# EAGLE design POE_PD_4_P-Schalter (EAGLE 6.5.0)
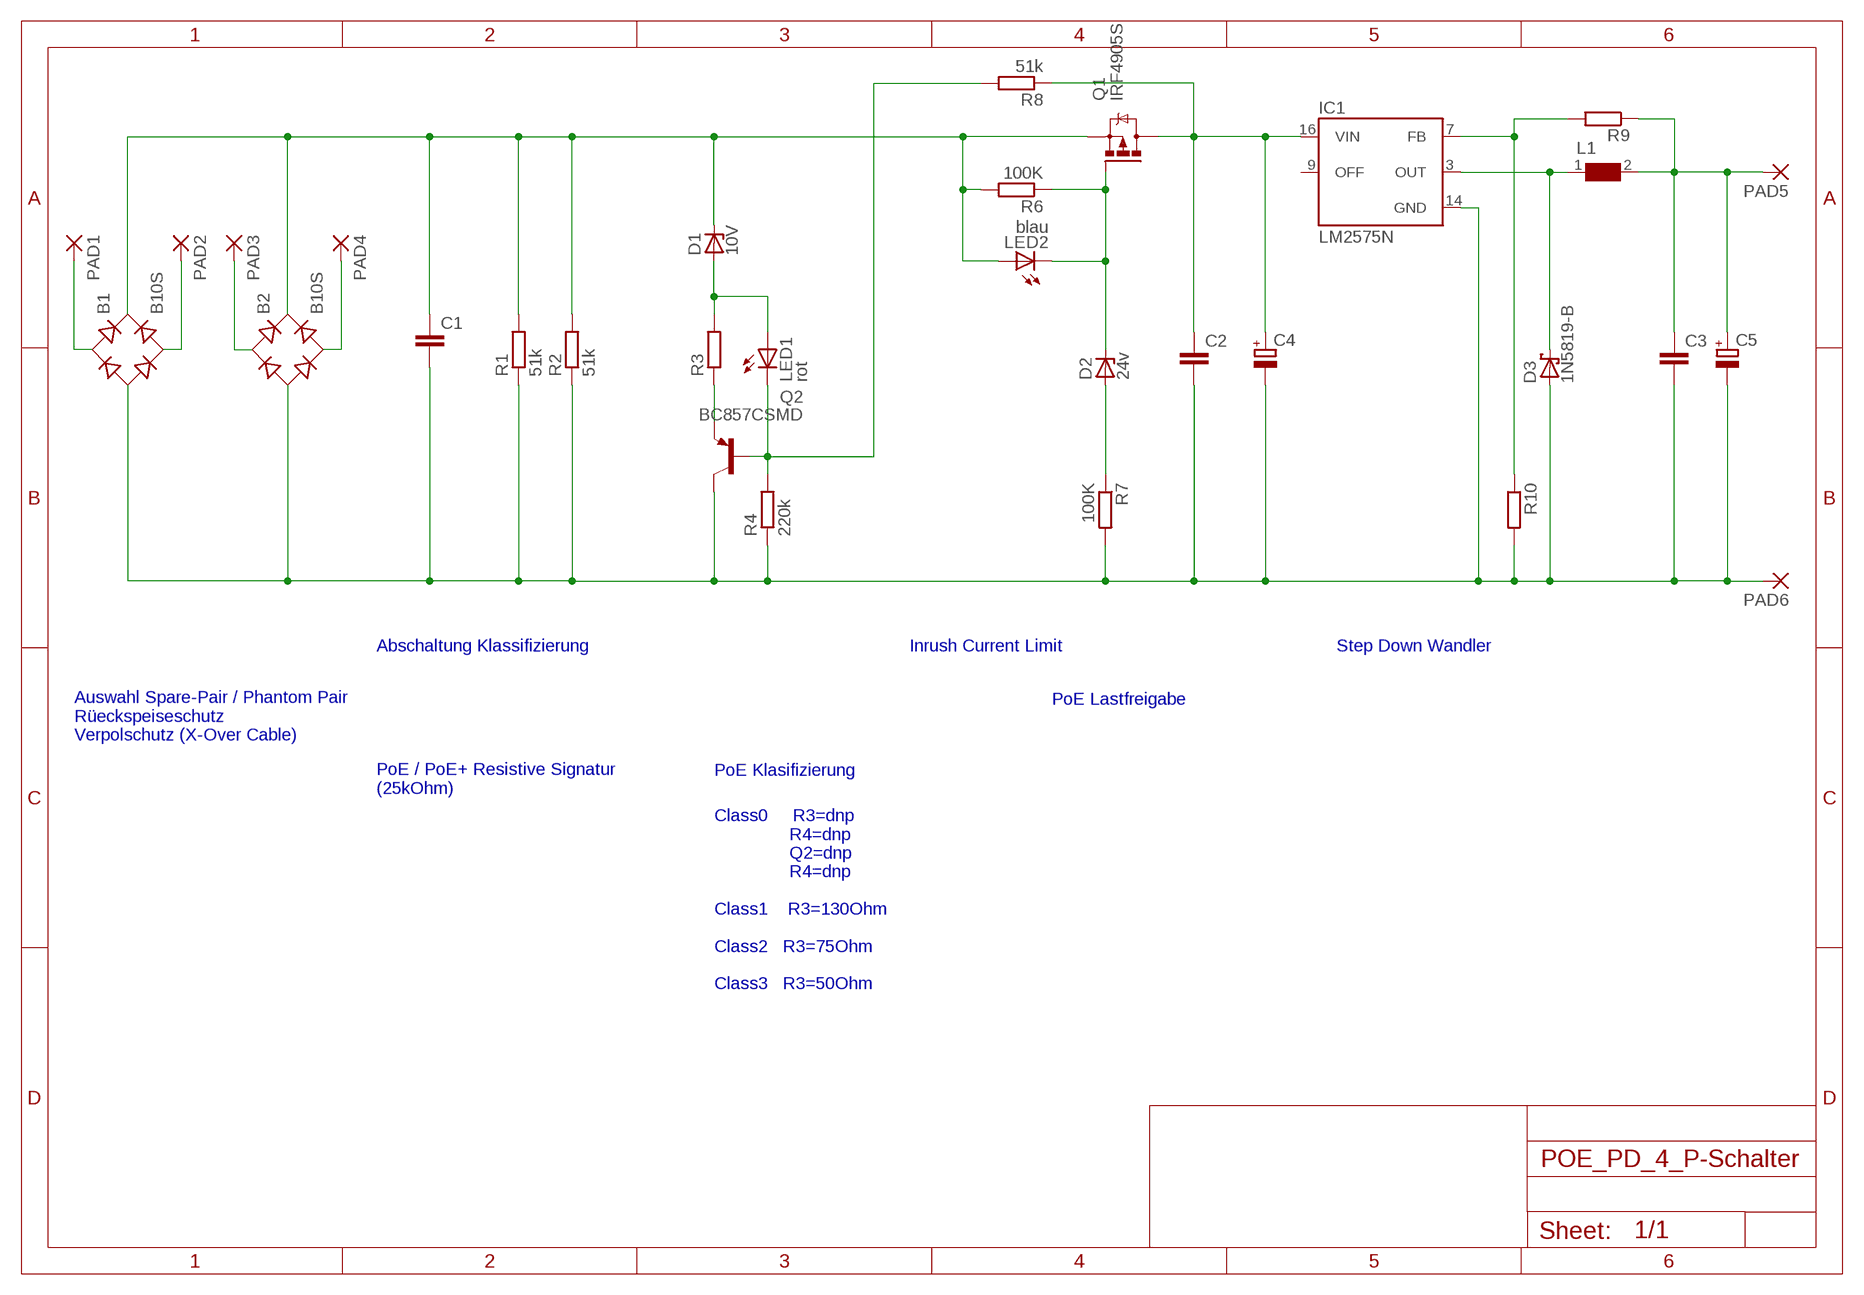
[diagram p0: schematic, sheet 1]

## Parts
B1  B10S  [MBS]
B2  B10S  [MBS]
C1  C-EUC0805  [C0805]
C2  C-EUC0805  [C0805]
C3  C-EUC0805  [C0805]
C4  CPOL-EU153CLV-0605  [153CLV-0605]
C5  CPOL-EU153CLV-0605  [153CLV-0605]
D1  10V  ZENER-DIODESOT23  [SOT23]
D2  24v  ZENER-DIODESOT23  [SOT23]
D3  1N5819-B  [DO41-7.6]
IC1  LM2575N  [DIL16]
L1  WE-PD2_S  [WE-PD2_S]
LED1  rot  LEDCHIP-LED0805  [CHIP-LED0805]
LED2  blau  LEDCHIP-LED0805  [CHIP-LED0805]
PAD1  2,15/1,0  [2,15/1,0]
PAD2  2,15/1,0  [2,15/1,0]
PAD3  2,15/1,0  [2,15/1,0]
PAD4  2,15/1,0  [2,15/1,0]
PAD5  2,15/1,0  [2,15/1,0]
PAD6  2,15/1,0  [2,15/1,0]
Q1  IRF4905S  IRFR5305  [D-PAK_TO252AA]
Q2  BC857CSMD  [SOT23-BEC]
R1  51k  R-EU_R0603  [R0603]
R2  51k  R-EU_R0603  [R0603]
R3  R-EU_R0603  [R0603]
R4  220k  R-EU_R0603  [R0603]
R6  100K  R-EU_R0603  [R0603]
R7  100K  R-EU_R0603  [R0603]
R8  51k  R-EU_R0603  [R0603]
R9  R-EU_R0603  [R0603]
R10  R-EU_R0603  [R0603]

## Nets
N$1: B1.- B2.- C1.2 C2.2 C3.2 C4.- C5.- D3.A IC1.14(GND) PAD6.1(P) Q2.C R1.1 R2.1 R4.1 R7.2 R10.2
N$4: Q2.E R3.1
N$5: B1.AC1 PAD1.1(P)
N$6: LED1.C Q2.B R4.2 R8.2
N$8: D1.1(A) LED1.A R3.2
N$9: D2.1(A) R7.1
N$10: B1.+ B2.+ C1.1 D1.3(C) LED2.A Q1.3(S) R1.2 R2.2 R6.2
N$11: D2.3(C) LED2.C Q1.1(G) R6.1
N$12: D3.C IC1.3(OUT) L1.1
N$13: C3.1 C5.+ L1.2 PAD5.1(P) R9.1
N$14: C2.1 C4.+ IC1.16(VIN) Q1.4(D) R8.1
N$15: IC1.7(FB) R9.2 R10.1
N$16: B1.AC2 PAD2.1(P)
N$17: B2.AC1 PAD3.1(P)
N$18: B2.AC2 PAD4.1(P)
Unconnected: IC1.9(OFF)

## Notes on the sheet
- Abschaltung Klassifizierung | Inrush Current Limit | Step Down Wandler
- PoE Lastfreigabe
- Auswahl Spare-Pair / Phantom Pair
  Rüeckspeiseschutz
  Verpolschutz (X-Over Cable)
- PoE Klasifizierung
- PoE / PoE+ Resistive Signatur
  (25kOhm)
- Class0     R3=dnp
                 R4=dnp
                 Q2=dnp
                 R4=dnp
  
  Class1    R3=130Ohm
  
  Class2   R3=75Ohm
  
  Class3   R3=50Ohm

## Library data of the parts
B1 B2 = rectifier:B*S: Surface Mount Glass Passivated Bridge Rectifiers Source: Comchip Bridge Rectifiers B05S-G_B10S-G.pdf
C1-C3 = rcl:C-EU: CAPACITOR, European symbol
C4 C5 = rcl:CPOL-EU: POLARIZED CAPACITOR, European symbol
D1 D2 = diode:ZENER-DIODE: Z-Diode
D3 = diode:1N581*: 1.0A SCHOTTKY BARRIER RECTIFIER Source: http://www.diodes.com/datasheets/ds23001.pdf
IC1 = v-reg-3:LM2575: National Semiconductor <http://www.national.com> 1.0A "Simple Switcher"(c) 52kHz, Vout 1.23-37V (HV: 57V), Vin 40V (HV: 60V), 50µA standby current
L1 = wuerth_elektronik_EAGLE:WE-PD2: SMD-Power Inductors WE-PD2 Is recommended for the application with switching regulators from National Semiconductor, Linear Technology, Texas Instruments and Fairchild Semiconductor -- Switching regulators with low operating voltages (computer, laptop, mobile phones, pagers) -- Integrated DC/DC-converter
LED1 LED2 = led:LED: LED OSRAM: - CHIPLED LG R971, LG N971, LY N971, LG Q971, LY Q971, LO R971, LY R971 LH N974, LH R974 LS Q976, LO Q976, LY Q976 LO Q996 - Hyper CHIPLED LW Q18S LB Q993, LB Q99A, LB R99A - SideLED LS A670, LO A670, LY A670, LG A670, LP A670 LB A673, LV A673, LT A673, LW A673 LH A674 LY A675 LS A676, LA A676, LO A676, LY A676, LW A676 LS A679, LY A679, LG A679 - Hyper Micro SIDELED® LS Y876, LA Y876, LO Y876, LY Y876 LT Y87S - SmartLED LW L88C, LW L88S LB L89C, LB L89S, LG L890 LS L89K, LO L89K, LY L89K LS L896, LA L896, LO L896, LY L896 - TOPLED LS T670, LO T670, LY T670, LG T670, LP T670 LSG T670, LSP T670, LSY T670, LOP T670, LYG T670 LG T671, LOG T671, LSG T671 LB T673, LV T673, LT T673, LW T673 LH T674 LS T676, LA T676, LO T676, LY T676, LB T676, LH T676, LSB T676, LW T676 LB T67C, LV T67C, LT T67C, LS T67K, LO T67K, LY T67K, LW E67C LS E67B, LA E67B, LO E67B, LY E67B, LB E67C, LV E67C, LT E67C LW T67C LS T679, LY T679, LG T679 LS T770, LO T770, LY T770, LG T770, LP T770 LB T773, LV T773, LT T773, LW T773 LH T774 LS E675, LA E675, LY E675, LS T675 LS T776, LA T776, LO T776, LY T776, LB T776 LHGB T686 LT T68C, LB T68C - Hyper Mini TOPLED® LB M676 - Mini TOPLED Santana® LG M470 LS M47K, LO M47K, LY M47K Source: http://www.osram.convergy.de LUXEON: - LUMILED® LXK2-PW12-R00, LXK2-PW12-S00, LXK2-PW14-U00, LXK2-PW14-V00 LXK2-PM12-R00, LXK2-PM12-S00, LXK2-PM14-U00 LXK2-PE12-Q00, LXK2-PE12-R00, LXK2-PE12-S00, LXK2-PE14-T00, LXK2-PE14-U00 LXK2-PB12-K00, LXK2-PB12-L00, LXK2-PB12-M00, LXK2-PB14-N00, LXK2-PB14-P00, LXK2-PB14-Q00 LXK2-PR12-L00, LXK2-PR12-M00, LXK2-PR14-Q00, LXK2-PR14-R00 LXK2-PD12-Q00, LXK2-PD12-R00, LXK2-PD12-S00 LXK2-PH12-R00, LXK2-PH12-S00 LXK2-PL12-P00, LXK2-PL12-Q00, LXK2-PL12-R00 Source: www.luxeon.com KINGBRIGHT: KA-3528ASYC Source: www.kingbright.com
PAD1-PAD6 = wirepad:2,15/1,0: THROUGH-HOLE PAD
Q1 = transistor-power:IRF?5305: HEXFET Power MOSFET Source: http://www.irf.com/product-info/datasheets/data/irfr5305pbf.pdf
Q2 = transistor-pnp:BC857*: PNP Transistror
R1-R4 R6-R10 = rcl:R-EU_: RESISTOR, European symbol

## Board
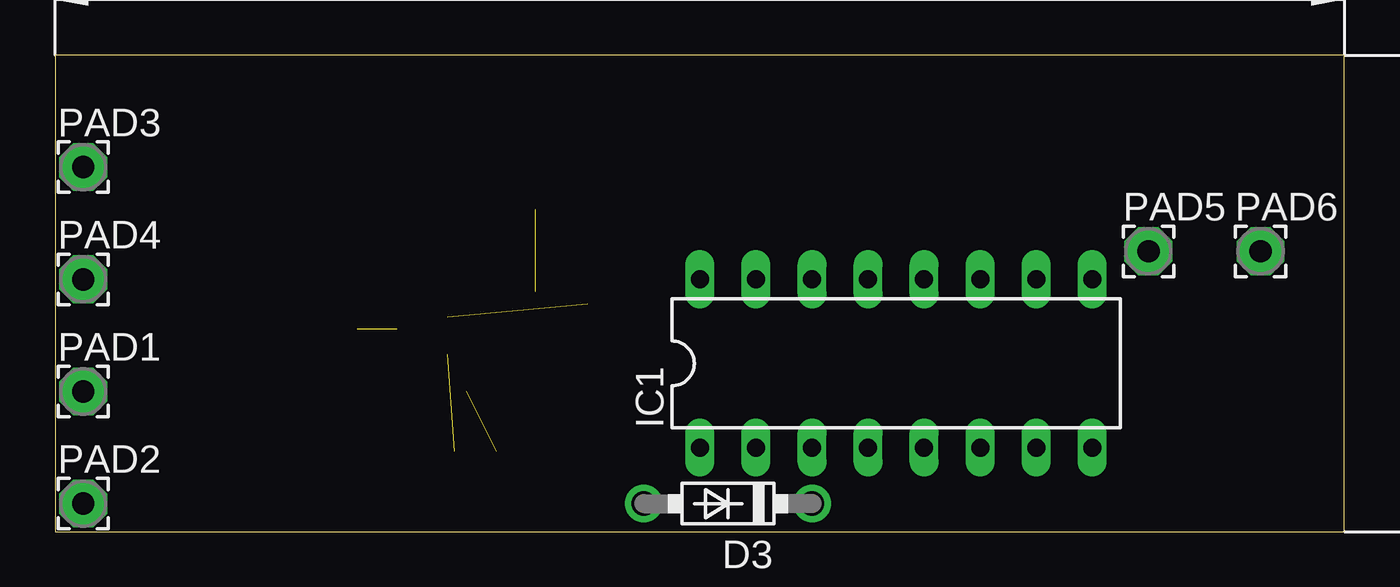
[diagram p1: board, top side]
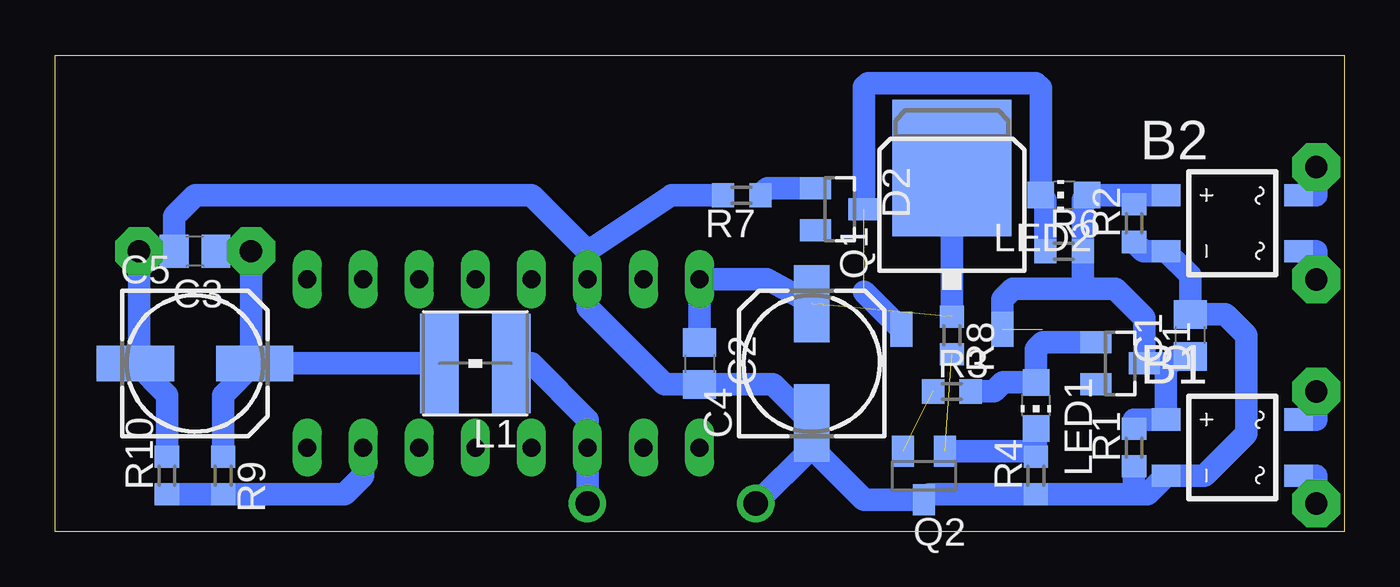
[diagram p2: board, bottom side, seen from below]

Size 58.41 x 21.58 mm. Coordinates in mm from the lower left corner, seen from the top.
Outline: 0,0 58.41,0 58.41,21.58 0,21.58 0,0
Copper layers (1*16): Top 0.035mm / dielectric 1.5mm / Bottom 0.035mm
Design rules "default": minimum track width 10mil, minimum drill 0.6mm, track to track 8mil, track to pad 8mil, pad to pad 8mil, via to via 8mil, smd to smd 8mil, copper to edge 40mil, drill to drill 8mil, minimum pad ring 10mil, minimum via ring 8mil, stop-mask expansion 4mil, vias tented up to drill 0mil, thermal gap 10mil

### Footprints (pad centres in the part's own frame; a part is rotated, then mirrored left to right if it is on the bottom)
MBS = smd 1 x 1.3: + -1.27,-3; - 1.27,-3; AC1 -1.27,3; AC2 1.27,3
C0805 = smd 1.3 x 1.5: 1 -0.95,0; 2 0.95,0
153CLV-0605 = smd 3.5 x 1.6: + 2.7,0; - -2.7,0
SOT23 = smd 1 x 1.4: 1 -0.95,-1.1; 2 0.95,-1.1; 3 0,1.1
DO41-7.6 = drill 1.1 pad 1.7: A 3.81,0; C -3.81,0
DIL16 = drill 0.813 long: 1 -8.89,-3.81; 2 -6.35,-3.81; 3 -3.81,-3.81; 4 -1.27,-3.81; 5 1.27,-3.81; 6 3.81,-3.81; 7 6.35,-3.81; 8 8.89,-3.81; 9 8.89,3.81; 10 6.35,3.81; 11 3.81,3.81; 12 1.27,3.81; 13 -1.27,3.81; 14 -3.81,3.81; 15 -6.35,3.81; 16 -8.89,3.81
WE-PD2_S = smd 1.75 x 4.5: 1 -1.625,0; 2 1.625,0
CHIP-LED0805 = smd 1.2 x 1.2: A 0,-1.05; C 0,1.05
2,15/1,0 = drill 1.016 pad 2.159 octagon: 1 0,0
D-PAK_TO252AA = smd 1 x 1.6: 1 -2.28,-4.8; 3 2.28,-4.8 | smd 5.4 x 6.2: 4 0,2.5
SOT23-BEC = smd 1 x 1.4: B -0.95,-1.1; C 0,1.1; E 0.95,-1.1
R0603 = smd 1 x 1.1: 1 -0.85,0; 2 0.85,0

### Placement (x,y rotation side)
B1  5.08,3.81 270 bottom
B2  5.08,13.97 270 bottom
C1  6.99,8.89 90 bottom
C2  29.21,7.62 270 bottom
C3  52.07,12.7 180 bottom
C4  24.13,7.62 90 bottom
C5  52.07,7.62 0 bottom
D1  10.16,7.62 270 bottom
D2  22.86,14.61 270 bottom
D3  30.48,1.27 180 top
IC1  38.1,7.62 0 top
L1  39.37,7.62 180 bottom
LED1  13.97,5.71 180 bottom
LED2  12.7,15.24 90 bottom
PAD1  1.27,6.35 0 top
PAD2  1.27,1.27 0 top
PAD3  1.27,16.51 0 top
PAD4  1.27,11.43 0 top
PAD5  49.53,12.7 0 top
PAD6  54.61,12.7 0 top
Q1  17.78,13.97 0 bottom
Q2  19.05,2.54 180 bottom
R1  9.53,3.81 90 bottom
R2  9.53,13.97 90 bottom
R3  17.78,6.35 0 bottom
R4  13.97,2.54 90 bottom
R6  12.7,12.7 0 bottom
R7  27.3,15.24 180 bottom
R8  17.78,8.89 270 bottom
R9  50.8,2.54 270 bottom
R10  53.34,2.54 90 bottom

### Tracks (layer width: path | path; a pad name or v marks a point on that pad's centre or on a via)
N$1
  Bottom 1.016: R7.2 30.48,15.24 34.29,12.7 | 34.29,12.7 IC1.14 34.29,10.16 30.8,6.67 C2.2 25.88,6.67 C4.- 24.13,3.81 | 34.29,12.7 36.83,15.24 52.07,15.24 53.02,14.29 C3.2 PAD6.1 54.61,7.78 C5.- 53.34,6.19 R10.2 | R2.1 9.11,12.7 B2.- 6.99,11.61 C1.2 5.39,9.84 4.45,8.89 4.45,4.45 6.35,2.54 B1.- 8.93,1.69 9.53,1.69 | 9.53,1.69 R4.1 18.8,1.69 Q2.C | R1.1 9.53,1.69 | Q2.C 19.05,1.27 | D3.A 24.13,3.81 | Q2.C 21.76,1.44 24.13,3.81
N$4  (1 unrouted)
N$5
  Bottom 1.016: B1.AC1 1.27,5.08 PAD1.1
N$6  (1 unrouted)
  Bottom 1.016: Q2.B 14.22,3.64 | 14.22,3.64 R4.2 | 14.22,3.64 14.14,3.64 13.97,3.81 LED1.C
N$8
  Bottom 1.016: D1.1 13.65,8.57 13.97,8.26 LED1.A 15.46,6.76 15.88,6.35 R3.2
N$9
  Bottom 1.016: D2.1 26.14,15.55 R7.1
N$10  (1 unrouted)
  Bottom 1.016: 11.85,11.01 R6.2 11.85,15.04 LED2.A 9.53,15.24 | D1.3 8.89,7.62 | 8.08,7.45 B1.+ 9.53,5.08 R1.2 | 8.08,7.45 8.26,7.62 D1.3 | C1.1 7.58,7.94 8.08,7.45 | D1.3 9.06,9.7 10.38,11.01 11.85,11.01 | B2.+ 9.53,15.24 | R2.2 9.53,15.24 | 11.85,11.01 15.03,11.01 15.5,10.54 Q1.3
N$11  (1 unrouted)
  Bottom 1.016: R6.1 13.55,15.04 LED2.C 13.75,20.1 13.97,20.32 21.59,20.32 21.76,20.15 D2.3 | 21.76,10.87 Q1.1
N$12
  Bottom 1.016: L1.1 36.83,7.62 34.29,5.08 IC1.3 D3.C
N$13
  Bottom 1.016: C3.1 PAD5.1 49.53,7.78 C5.+ | L1.2 C5.+ | R9.1 50.8,6.19 C5.+
N$14  (1 unrouted)
  Bottom 1.016: C4.+ 26.16,11.43 IC1.16 C2.1 | R8.1 Q1.4
N$15
  Bottom 1.016: R10.1 R9.2 45.3,1.69 44.45,2.54 IC1.7
N$16
  Bottom 1.016: B1.AC2 1.27,2.54 PAD2.1
N$17
  Bottom 1.016: B2.AC1 1.27,15.24 PAD3.1
N$18
  Bottom 1.016: B2.AC2 1.27,12.7 PAD4.1